# EAGLE design Shield_INA219 (EAGLE 9.4.2)
COMPANY: Unexpected Maker; DATE: 24-10-2018; DRAWN: Seon; REV: V1; TITLE: TinyPICO
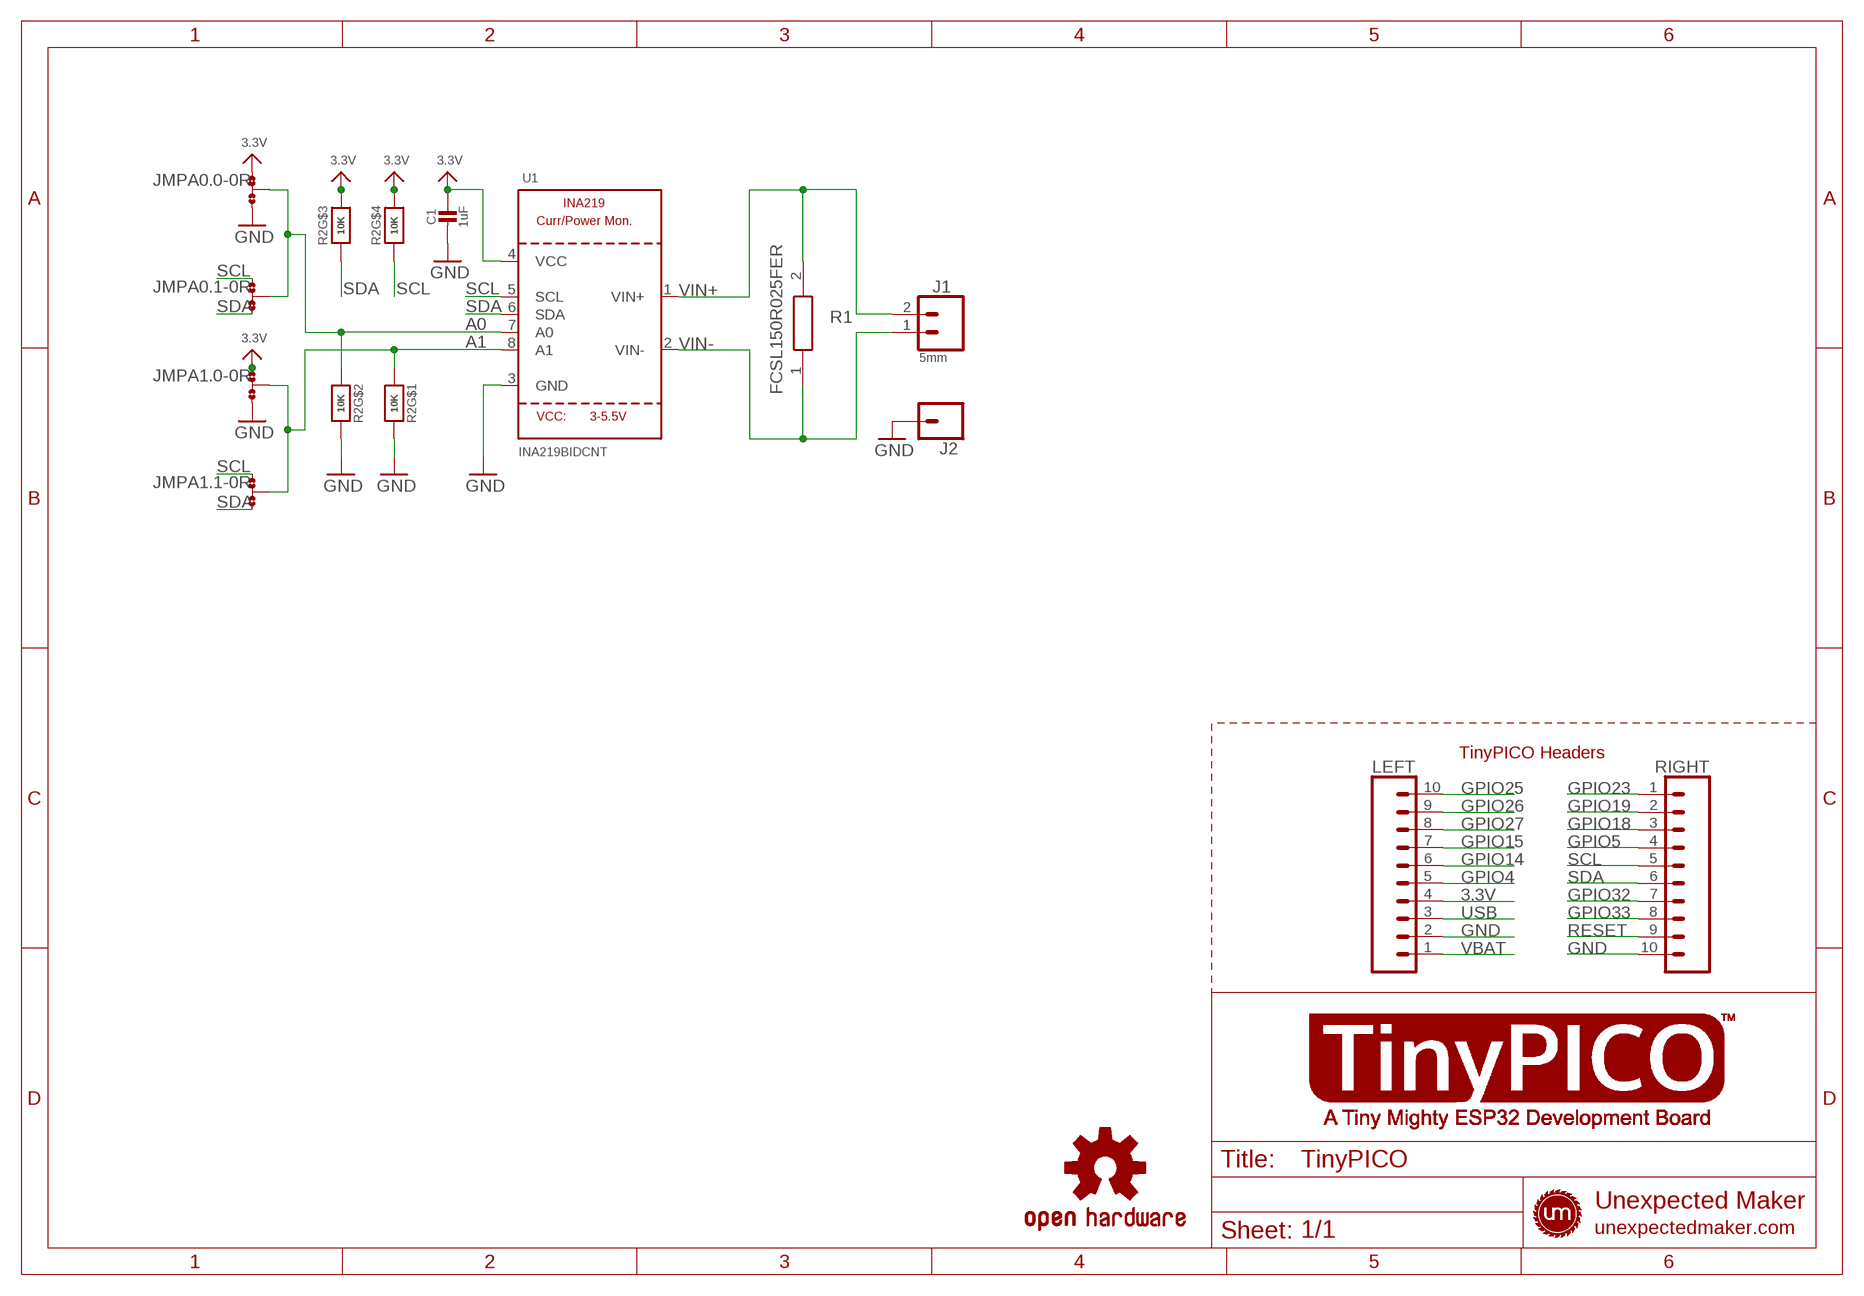
[diagram p0: schematic, sheet 1]

## Parts
C1  1uF  CAP_CERAMIC0805-NOOUTLINE  [0805-NO@1]
J1  5mm  CONN_025MM  [SCREWTERMINAL-5MM-2]
J2  CONN_01  [1X01]
JMPA0.0  0R-JUMPD  [C0R-JMP_NONE]
JMPA0.1  0R-JUMPD  [C0R-JMP_NONE]
JMPA1.0  0R-JUMPD  [C0R-JMP_NONE]
JMPA1.1  0R-JUMPD  [C0R-JMP_NONE]
LEFT  TINYPICO_HEADER_10NO_SILK_PTH_FEMALE  [1X10_NO_SILK]
LOGO1  OSHW-LOGOS  [OSHW-LOGO-S]
R1  FCSL150R025FER  [RESC90152X87N]
R2  10K  RESISTOR_4PACK  [RESPACK_4X0603]
RIGHT  TINYPICO_HEADER_10NO_SILK_PTH_FEMALE  [1X10_NO_SILK]
U1  INA219BIDCNT  INA219  [SOT23-8]

## Nets
3.3V: C1.1 JMPA0.0.1 JMPA1.0.1 LEFT.4 R2.5 R2.6 U1.4(VCC)
A0: JMPA0.0.2 JMPA0.1.2 R2.2 U1.7(A0)
A1: JMPA1.0.2 JMPA1.1.2 R2.1 U1.8(A1)
GND: C1.2 J2.1 JMPA0.0.3 JMPA1.0.3 LEFT.2 R2.7 R2.8 RIGHT.10 U1.3(GND)
GPIO4: LEFT.5
GPIO5: RIGHT.4
GPIO14: LEFT.6
GPIO15: LEFT.7
GPIO18: RIGHT.3
GPIO19: RIGHT.2
GPIO23: RIGHT.1
GPIO25: LEFT.10
GPIO26: LEFT.9
GPIO27: LEFT.8
GPIO32: RIGHT.7
GPIO33: RIGHT.8
RESET: RIGHT.9
SCL: JMPA0.1.1 JMPA1.1.1 R2.4 RIGHT.5 U1.5(SCL)
SDA: JMPA0.1.3 JMPA1.1.3 R2.3 RIGHT.6 U1.6(SDA)
USB: LEFT.3
VBAT: LEFT.1
VIN+: J1.2 R1.2 U1.1(VIN+)
VIN-: J1.1 R1.1 U1.2(VIN-)

## Notes on the sheet
- TinyPICO Headers

## Library data of the parts
C1 = microbuilder:CAP_CERAMIC: Ceramic Capacitors For new designs, use the packages preceded by an '_' character since they are more reliable: The following footprints should be used on most boards: _0402 - Standard footprint for regular board layouts _0603 - Standard footprint for regular board layouts _0805 - Standard footprint for regular board layouts _1206 - Standard footprint for regular board layouts For extremely tight-pitch boards where space is at a premium, the following 'micro-pitch' footprints can be used (smaller pads, no silkscreen outline, etc.): _0402MP - Micro-pitch footprint for very dense/compact boards _0603MP - Micro-pitch footprint for very dense/compact boards _0805MP - Micro-pitch footprint for very dense/compact boards _1206MP - Micro-pitch footprint for very dense/compact boards
J1 = SparkFun-Connectors:CONN_02: Multi connection point. Often used as Generic Header-pin footprint for 0.1 inch spaced/style header connections On any of the 0.1 inch spaced packages, you can populate with these: Break Away Headers - Straight <https://www.sparkfun.com/products/116> (PRT-00116) Break Away Male Headers - Right Angle <https://www.sparkfun.com/products/553> (PRT-00553) Female Headers <https://www.sparkfun.com/products/115> (PRT-00115) Break Away Headers - Machine Pin <https://www.sparkfun.com/products/117> (PRT-00117) Break Away Female Headers - Swiss Machine Pin <https://www.sparkfun.com/products/743> (PRT-00743) For SCREWTERMINALS and SPRING TERMINALS visit here: Screw Terimnals on SparkFun.com <https://www.sparkfun.com/search/results?term=Screw+Terminals> (5mm/3.5mm/2.54mm spacing) This device is also useful as a general connection point to wire up your design to another part of your project. Our various solder wires solder well into these plated through hole pads. Hook-Up Wire - Assortment (Stranded, 22 AWG) <https://www.sparkfun.com/products/11375> (PRT-11375) Hook-Up Wire - Assortment (Solid Core, 22 AWG) <https://www.sparkfun.com/products/11367> (PRT-11367) View the entire wire category on our website here <https://www.sparkfun.com/categories/141> Special notes: Molex polarized connector foot print use with: PRT-08233 with associated crimp pins and housings. 2.54_SCREWTERM for use with PRT-10571. 3.5mm Screw Terminal footprints for PRT-08084 5mm Screw Terminal footprints for use with PRT-08432; SF_SKU: PRT-08432
J2 = SparkFun-Connectors:CONN_01: Single connection point. Often used as Generic Header-pin footprint for 0.1 inch spaced/style header connections On any of the 0.1 inch spaced packages, you can populate with these: Break Away Headers - Straight <https://www.sparkfun.com/products/116> (PRT-00116) Break Away Male Headers - Right Angle <https://www.sparkfun.com/products/553> (PRT-00553) Female Headers <https://www.sparkfun.com/products/115> (PRT-00115) Break Away Headers - Machine Pin <https://www.sparkfun.com/products/117> (PRT-00117) Break Away Female Headers - Swiss Machine Pin <https://www.sparkfun.com/products/743> (PRT-00743) This device is also useful as a general connection point to wire up your design to another part of your project. Our various solder wires solder well into these plated through hole pads. Hook-Up Wire - Assortment (Stranded, 22 AWG) <https://www.sparkfun.com/products/11375> (PRT-11375) Hook-Up Wire - Assortment (Solid Core, 22 AWG) <https://www.sparkfun.com/products/11367> (PRT-11367) View the entire wire category on our website here <https://www.sparkfun.com/categories/141> Special notes: SMTSO-256-ET is a "flush mount" nut for a 4-40 screw. We mostly use this on specialty testbeds; it is a nice way to connect hardware to your PCB at an adjustable hieght. Also note, the SNAP packages are for using a snappable style connector. We sell a baggie of snaps and they are also used on two LilyPad designs: Snap Assortment - 30 pack (male and female) <https://www.sparkfun.com/products/11347> (DEV-11347) LilyPad Arduino SimpleSnap <https://www.sparkfun.com/products/10941> (DEV-10941) LilyPad SimpleSnap Protoboard <https://www.sparkfun.com/products/10940> (DEV-10940)
JMPA0.0 JMPA0.1 JMPA1.0 JMPA1.1 = pv_jump-0r-smd:0R-JUMP: SMD 0R 0805 Jumper
LEFT RIGHT = UnexpectedMaker:TINYPICO_HEADER_10: Multi connection point. Often used as Generic Header-pin footprint for 0.1 inch spaced/style header connections On any of the 0.1 inch spaced packages, you can populate with these: Break Away Headers - Straight <https://www.sparkfun.com/products/116> (PRT-00116) Break Away Male Headers - Right Angle <https://www.sparkfun.com/products/553> (PRT-00553) Female Headers <https://www.sparkfun.com/products/115> (PRT-00115) Break Away Headers - Machine Pin <https://www.sparkfun.com/products/117> (PRT-00117) Break Away Female Headers - Swiss Machine Pin <https://www.sparkfun.com/products/743> (PRT-00743) Arduino Stackable Header - 10 Pin <https://www.sparkfun.com/products/11376> (PRT-11376) For SCREWTERMINALS and SPRING TERMINALS visit here: Screw Terimnals on SparkFun.com <https://www.sparkfun.com/search/results?term=Screw+Terminals> (5mm/3.5mm/2.54mm spacing) This device is also useful as a general connection point to wire up your design to another part of your project. Our various solder wires solder well into these plated through hole pads. Hook-Up Wire - Assortment (Stranded, 22 AWG) <https://www.sparkfun.com/products/11375> (PRT-11375) Hook-Up Wire - Assortment (Solid Core, 22 AWG) <https://www.sparkfun.com/products/11367> (PRT-11367) View the entire wire category on our website here <https://www.sparkfun.com/categories/141> Special notes: Molex polarized connector foot print use with SKU : PRT-08231 with associated crimp pins and housings. 1MM SMD Version SKU: PRT-10208 NOTES ON THE VARIANTS LOCK and LOCK_LONGPADS... This footprint was designed to help hold the alignment of a through-hole component (i.e. 6-pin header) while soldering it into place. You may notice that each hole has been shifted either up or down by 0.005 of an inch from it's more standard position (which is a perfectly straight line). This slight alteration caused the pins (the squares in the middle) to touch the edges of the holes. Because they are alternating, it causes a "brace" to hold the component in place. 0.005 has proven to be the perfect amount of "off-center" position when using our standard breakaway headers. Although looks a little odd when you look at the bare footprint, once you have a header in there, the alteration is very hard to notice. Also,if you push a header all the way into place, it is covered up entirely on the bottom side.; PROD_ID: CONN-11563
LOGO1 = SparkFun-Aesthetics:OSHW-LOGO: Open-Source Hardware (OSHW) Logo This logo indicates the piece of hardware it is found on incorporates a OSHW license and/or adheres to the definition of open source hardware found here: http://freedomdefined.org/OSHW
R1 = pv:FCSL150R025FER: OHMITE - FCSL150R025FER - CURRENT SENSE RES, 0R025, 1%, 10 W, 6030 Source: Datasheet <https://mouser.componentsearchengine.com/Datasheets/2/FCSL150R025FER.pdf>; DESCRIPTION: OHMITE - FCSL150R025FER - CURRENT SENSE RES, 0R025, 1%, 10 W, 6030; HEIGHT: 0.874mm; MANUFACTURER_NAME: Ohmite; MANUFACTURER_PART_NUMBER: FCSL150R025FER
R2 = microbuilder:RESISTOR_4PACK: Resistor Packs (4 resistors) 4 x 0603 10K 1/16W - Digikey: YC164J-10KCT-ND
U1 = microbuilder:INA219: INA219 - I2C Current/Power Monitor Voltage Range: 0-26V Accuracy: 0.5% Temperature: -40°C - 125°C

## Board
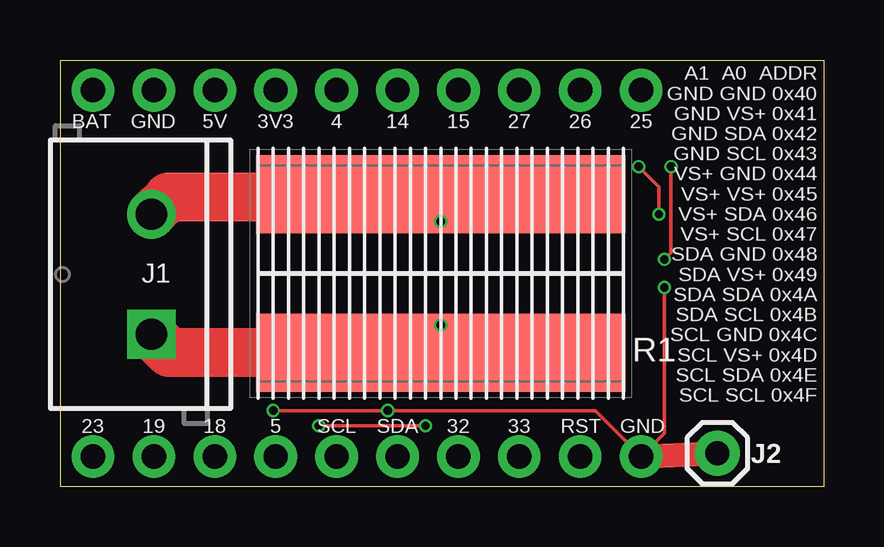
[diagram p1: board, top side]
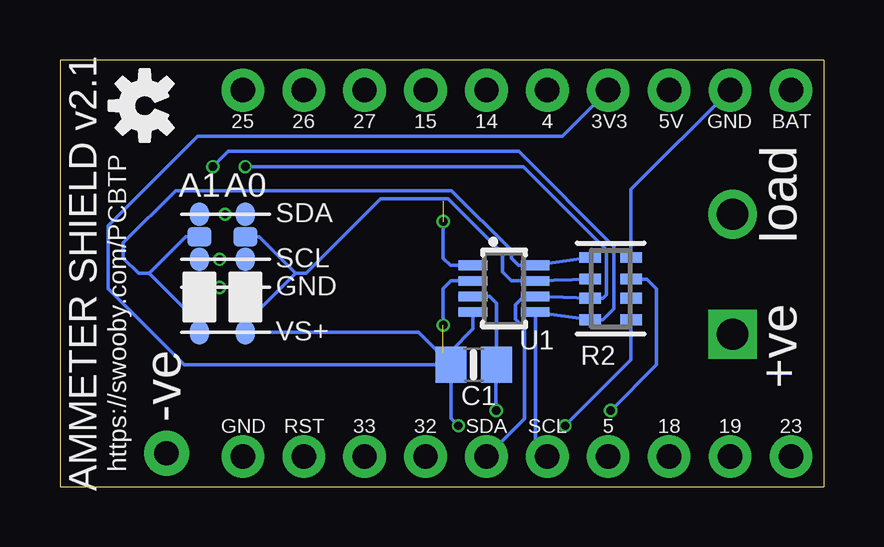
[diagram p2: board, bottom side, seen from below]

Size 31.85 x 17.78 mm. Coordinates in mm from the lower left corner, seen from the top.
Outline: 31.85,0 0,0 0,17.78 31.85,17.78 31.85,0
Copper layers (1*16): Top 0.035mm / dielectric 1.5mm / Bottom 0.035mm
Design rules "UnexpectedMaker_JLCPCB 2 Layer": minimum track width 6mil, minimum drill 10mil, track to track 6mil, track to pad 6mil, pad to pad 6mil, via to via 6mil, smd to smd 6mil, copper to edge 9mil, drill to drill 7mil, minimum pad ring 4mil, minimum via ring 4mil, stop-mask expansion 4mil, vias tented up to drill 25mil, thermal gap 10mil
tRestrict: area 8.3,7 to 23.5,10.8
vRestrict: area 8.3,7 to 23.5,10.8

### Footprints (pad centres in the part's own frame; a part is rotated, then mirrored left to right if it is on the bottom)
0805-NO@1 = smd 1.3 x 1.5: 1 -0.95,0; 2 0.95,0
SCREWTERMINAL-5MM-2 = drill 1.3 pad 2.032 square: 1 0,0 | drill 1.3 pad 2.032: 2 5,0
1X01 = drill 1.016 pad 1.88: 1 0,0
C0R-JMP_NONE = smd 0.8 x 1: 1 0,0.938; 3 0,-0.938 | smd 1 x 0.8: 2 0,0
1X10_NO_SILK = drill 1.016 pad 1.778: 1 0,0; 2 2.54,0; 3 5.08,0; 4 7.62,0; 5 10.16,0; 6 12.7,0; 7 15.24,0; 8 17.78,0; 9 20.32,0; 10 22.86,0
RESC90152X87N = smd 3.25 x 15.4: 1 -3.3,0; 2 3.3,0
RESPACK_4X0603 = smd 0.45 x 0.9: 1 -1.3,-0.85; 2 -0.4,-0.85; 3 0.4,-0.85; 4 1.3,-0.85; 5 1.3,0.85; 6 0.4,0.85; 7 -0.4,0.85; 8 -1.3,0.85
SOT23-8 = smd 0.4 x 1.2: 1 -0.975,-1.3; 2 -0.325,-1.3; 3 0.325,-1.3; 4 0.975,-1.3; 5 0.975,1.3; 6 0.325,1.3; 7 -0.325,1.3; 8 -0.975,1.3

### Placement (x,y rotation side)
C1  14.61,5.08 0 bottom
J1  3.81,6.35 90 top
J2  27.41,1.4 180 top
JMPA0.0  24.13,7.37 180 bottom
JMPA0.1  24.13,10.41 180 bottom
JMPA1.0  26.04,7.37 180 bottom
JMPA1.1  26.04,10.41 180 bottom
LEFT  1.37,16.52 0 top
LOGO1  28.32,15.88 90 bottom
R1  15.88,8.89 90 top
R2  8.89,8.26 270 bottom
RIGHT  1.37,1.26 0 top
U1  13.34,8.26 270 bottom

### Tracks (layer width: path | path; a pad name or v marks a point on that pad's centre or on a via)
3.3V  (via drill 0.35)
  Top 0.152: v15.24,2.54 v10.79,2.54
  Bottom 0.152: R2.6 R2.5 8.04,5.29 v10.79,2.54 | LEFT.4 10.91,14.6 26.12,14.6 29.84,10.87 29.84,8.26 27.3,5.71 26.67,5.08 C1.1 | JMPA1.0.1 JMPA0.0.1 16.9,6.43 C1.1 | C1.1 15.55,2.85 v15.24,2.54 | U1.4 14.63,6.57 15.55,5.65 C1.1
A0
  Bottom 0.152: JMPA0.1.2 23.55,10.41 22.02,8.89 | JMPA0.0.2 23.55,7.37 22.02,8.89 | 22.02,8.89 21.59,8.89 18.49,11.99 15.67,11.99 13.41,9.73 13.41,8.97 13.03,8.58 U1.7 R2.2
A1
  Bottom 0.152: JMPA1.1.2 26.62,10.41 28.14,8.89 | JMPA1.0.2 26.62,7.37 28.14,8.89 | 28.14,8.89 28.57,8.89 29.21,9.53 29.21,10.16 27.04,12.34 15.52,12.34 13.03,9.84 13.03,9.53 12.73,9.23 U1.8 R2.1
GND  (via drill 0.35)
  Top 0.152: v8.89,3.17 v13.66,3.17 22.31,3.17 RIGHT.10 25.2,2.22 v25.2,8.31
  Top 1.016: RIGHT.10 J2.1
  Bottom 0.152: LEFT.2 8.04,12.39 R2.8 R2.7 7.38,8.65 6.99,8.26 6.99,5.08 v8.89,3.17 | U1.3 13.95,7.93 13.65,7.63 C1.2 v13.66,3.17 | JMPA1.0.3 24.97,8.3 | 24.97,8.3 v25.2,8.31 | JMPA0.0.3 24.97,8.3
SCL  (via drill 0.35)
  Top 0.152: v25.48,13.34 25.48,9.75 v25.2,9.47
  Bottom 0.152: JMPA0.1.1 24.97,9.48 v25.2,9.47 JMPA1.1.1 | RIGHT.5 12.04,1.76 U1.5 R2.4 9.22,6.96 8.76,7.42 8.76,10 12.73,13.97 24.84,13.97 25.27,13.54 v25.48,13.34
SDA  (via drill 0.35)
  Top 0.152: v24.97,11.35 24.97,12.5 v24.13,13.34
  Bottom 0.152: JMPA1.1.3 24.99,11.35 v24.97,11.35 JMPA0.1.3 | RIGHT.6 12.5,2.83 12.5,6.62 12.86,6.99 12.86,7.58 12.51,7.93 U1.6 R2.3 9.21,7.86 9.06,8.01 9.06,9.88 12.52,13.34 v24.13,13.34
VIN+  (via drill 0.35)  (1 unrouted)
  Top 2.032: J1.2 4.53,12.06 15.75,12.06 R1.2 15.88,11.89
  Bottom 0.152: U1.1 15.58,9.23 15.88,9.53 v15.88,11.05
VIN-  (via drill 0.35)  (1 unrouted)
  Top 2.032: R1.1 4.57,5.59 J1.1
  Bottom 0.152: U1.2 15.55,8.58 15.88,8.26 v15.88,6.73

### Text on the board
tPlace: A1 A0 ADDR / GND GND 0x40 / GND VS+ 0x41 / GND SDA 0x42 / GND SCL 0x43 / VS+ GND 0x44 / VS+ VS+ 0x45 / VS+ SDA 0x46 / VS+ SCL 0x47 / SDA GND 0x48 / SDA VS+ 0x49 / SDA SDA 0x4A / SDA SCL 0x4B / SCL GND 0x4C / SCL VS+ 0x4D / SCL SDA 0x4E / SCL SCL 0x4F
bPlace: load | AMMETER SHIELD v2.1 | +ve | https://swooby.com/PCBTP | -ve
tNames: BAT | GND | 5V | 3V3 | 4 | 14 | 15 | 27 | 26 | 25 | 23 | 19 | 18 | 5 | SCL | SDA | 32 | 33 | RST | GND
bNames: BAT | GND | 5V | 3V3 | 4 | 14 | 15 | 27 | 26 | 25 | A0 | A1 | SDA | SCL | GND | VS+ | 23 | 19 | 18 | 5 | SCL | SDA | 32 | 33 | RST | GND